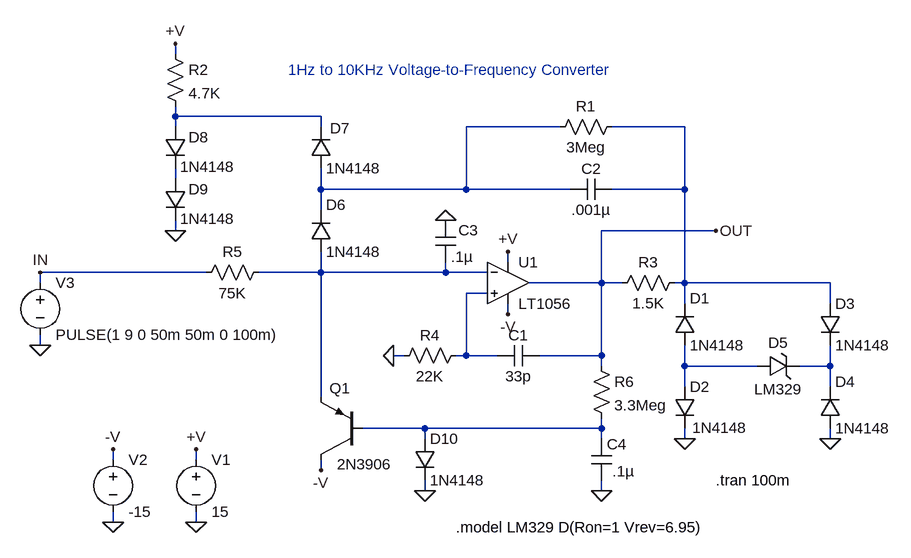
[diagram p0: schematic 1056.asc]
1056.asc, the LTspice schematic file:
Version 4
SHEET 1 896 688
WIRE -320 -112 -320 -128
WIRE -320 -16 -320 -32
WIRE -96 -16 -320 -16
WIRE -320 0 -320 -16
WIRE -96 0 -96 -16
WIRE 272 0 128 0
WIRE 464 0 352 0
WIRE -320 80 -320 64
WIRE -96 96 -96 64
WIRE 128 96 128 0
WIRE 128 96 -96 96
WIRE 288 96 128 96
WIRE 464 96 464 0
WIRE 464 96 352 96
WIRE -96 128 -96 96
WIRE -320 160 -320 144
WIRE 512 160 336 160
WIRE 192 208 192 192
WIRE -272 224 -528 224
WIRE -96 224 -96 192
WIRE -96 224 -192 224
WIRE 96 224 96 208
WIRE 96 224 -96 224
WIRE 160 224 96 224
WIRE -528 240 -528 224
WIRE 336 240 336 160
WIRE 336 240 224 240
WIRE 368 240 336 240
WIRE 464 240 464 96
WIRE 464 240 448 240
WIRE 688 240 464 240
WIRE 160 256 128 256
WIRE 464 272 464 240
WIRE 688 272 688 240
WIRE 192 288 192 272
WIRE -528 336 -528 320
WIRE 32 352 16 352
WIRE 128 352 128 256
WIRE 128 352 112 352
WIRE 176 352 128 352
WIRE 336 352 336 240
WIRE 336 352 240 352
WIRE 336 368 336 352
WIRE 464 368 464 336
WIRE 576 368 464 368
WIRE 688 368 688 336
WIRE 688 368 640 368
WIRE 464 400 464 368
WIRE 688 400 688 368
WIRE -96 416 -96 224
WIRE 64 464 -32 464
WIRE 336 464 336 448
WIRE 336 464 64 464
WIRE 64 480 64 464
WIRE 336 480 336 464
WIRE 464 480 464 464
WIRE 688 480 688 464
WIRE -416 512 -416 496
WIRE -288 512 -288 496
WIRE -96 528 -96 512
WIRE 64 560 64 544
WIRE 336 560 336 544
WIRE -416 608 -416 592
WIRE -288 608 -288 592
FLAG -288 608 0
FLAG 192 192 +V
FLAG -288 496 +V
FLAG 192 288 -V
FLAG -416 608 0
FLAG -416 496 -V
FLAG 464 480 0
FLAG 688 480 0
FLAG 96 144 0
FLAG -320 160 0
FLAG -320 -128 +V
FLAG 16 352 0
FLAG -528 336 0
FLAG 64 560 0
FLAG 336 560 0
FLAG -96 528 -V
FLAG 512 160 OUT
FLAG -528 224 IN
SYMBOL voltage -288 496 R0
SYMATTR InstName V1
SYMATTR Value 15
SYMBOL voltage -416 496 R0
SYMATTR InstName V2
SYMATTR Value -15
SYMBOL cap 240 336 R90
WINDOW 0 0 32 VBottom 2
WINDOW 3 32 32 VTop 2
SYMATTR InstName C1
SYMATTR Value 33p
SYMBOL res 352 256 R270
WINDOW 0 32 56 VTop 2
WINDOW 3 0 56 VBottom 2
SYMATTR InstName R3
SYMATTR Value 1.5K
SYMBOL diode 448 336 M180
WINDOW 0 24 72 Left 2
WINDOW 3 24 0 Left 2
SYMATTR InstName D1
SYMATTR Value 1N4148
SYMBOL diode 448 400 R0
WINDOW 3 28 63 Left 2
SYMATTR Value 1N4148
SYMATTR InstName D2
SYMBOL diode 672 272 R0
SYMATTR InstName D3
SYMATTR Value 1N4148
SYMBOL diode 672 464 M180
WINDOW 0 24 72 Left 2
WINDOW 3 24 0 Left 2
SYMATTR InstName D4
SYMATTR Value 1N4148
SYMBOL zener 576 384 R270
WINDOW 0 36 32 VTop 2
WINDOW 3 -4 32 VBottom 2
SYMATTR InstName D5
SYMATTR Value LM329
SYMBOL cap 352 80 R90
WINDOW 0 0 32 VBottom 2
WINDOW 3 32 32 VTop 2
SYMATTR InstName C2
SYMATTR Value .001µ
SYMBOL res 368 -16 R90
WINDOW 0 0 56 VBottom 2
WINDOW 3 32 56 VTop 2
SYMATTR InstName R1
SYMATTR Value 3Meg
SYMBOL cap 80 208 M180
WINDOW 0 36 49 Left 2
WINDOW 3 24 8 Left 2
SYMATTR InstName C3
SYMATTR Value .1µ
SYMBOL diode -112 192 M180
WINDOW 0 24 72 Left 2
WINDOW 3 24 0 Left 2
SYMATTR InstName D6
SYMATTR Value 1N4148
SYMBOL diode -112 64 M180
WINDOW 0 30 62 Left 2
WINDOW 3 24 0 Left 2
SYMATTR InstName D7
SYMATTR Value 1N4148
SYMBOL diode -336 80 R0
WINDOW 0 36 16 Left 2
WINDOW 3 23 61 Left 2
SYMATTR InstName D9
SYMATTR Value 1N4148
SYMBOL res -336 -128 R0
SYMATTR InstName R2
SYMATTR Value 4.7K
SYMBOL res 128 336 R90
WINDOW 0 0 56 VBottom 2
WINDOW 3 32 56 VTop 2
SYMATTR InstName R4
SYMATTR Value 22K
SYMBOL diode -336 0 R0
WINDOW 0 36 16 Left 2
WINDOW 3 23 61 Left 2
SYMATTR InstName D8
SYMATTR Value 1N4148
SYMBOL res -176 208 R90
WINDOW 0 0 56 VBottom 2
WINDOW 3 32 56 VTop 2
SYMATTR InstName R5
SYMATTR Value 75K
SYMBOL pnp -32 512 R180
WINDOW 0 51 110 Right 2
WINDOW 3 39 -7 Right 2
SYMATTR InstName Q1
SYMATTR Value 2N3906
SYMBOL diode 48 480 R0
SYMATTR InstName D10
SYMATTR Value 1N4148
SYMBOL cap 320 480 R0
WINDOW 3 33 50 Left 2
SYMATTR Value .1µ
SYMATTR InstName C4
SYMBOL res 320 352 R0
SYMATTR InstName R6
SYMATTR Value 3.3Meg
SYMBOL voltage -528 224 R0
WINDOW 123 0 0 Left 2
WINDOW 39 0 0 Left 2
SYMATTR InstName V3
SYMATTR Value PULSE(1 9 0 50m 50m 0 100m)
SYMBOL opamps\\LT1056 192 176 R0
SYMATTR InstName U1
TEXT 112 616 Left 2 !.model LM329 D(Ron=1 Vrev=6.95)
TEXT 512 544 Left 2 !.tran 100m
TEXT 104 -72 Bottom 2 ;1Hz to 10KHz Voltage-to-Frequency Converter

The netlist it stands for:
* 1056.asc
V1 +V 0 15
V2 -V 0 -15
C1 OUT N006 33p
R3 OUT N003 1.5K
D1 N007 N003 1N4148
D2 N007 0 1N4148
D3 N003 N008 1N4148
D4 0 N008 1N4148
D5 N007 N008 LM329
C2 N003 N002 .001µ
R1 N003 N002 3Meg
C3 N005 0 .1µ
D6 N005 N002 1N4148
D7 N002 N001 1N4148
D9 N004 0 1N4148
R2 +V N001 4.7K
R4 N006 0 22K
D8 N001 N004 1N4148
R5 N005 IN 75K
Q1 -V N009 N005 0 2N3906
D10 N009 0 1N4148
C4 N009 0 .1µ
R6 OUT N009 3.3Meg
V3 IN 0 PULSE(1 9 0 50m 50m 0 100m)
XU1 N006 N005 +V -V OUT LT1056  ; pins In+ In- V+ V- OUT
.model D D
.lib standard.dio
.model NPN NPN
.model PNP PNP
.lib standard.bjt
.model LM329 D(Ron=1 Vrev=6.95)
.tran 100m
* 1Hz to 10KHz Voltage-to-Frequency Converter
.backanno
.end